# EAGLE design Smart_IOT_v1 (EAGLE 6.6.0)
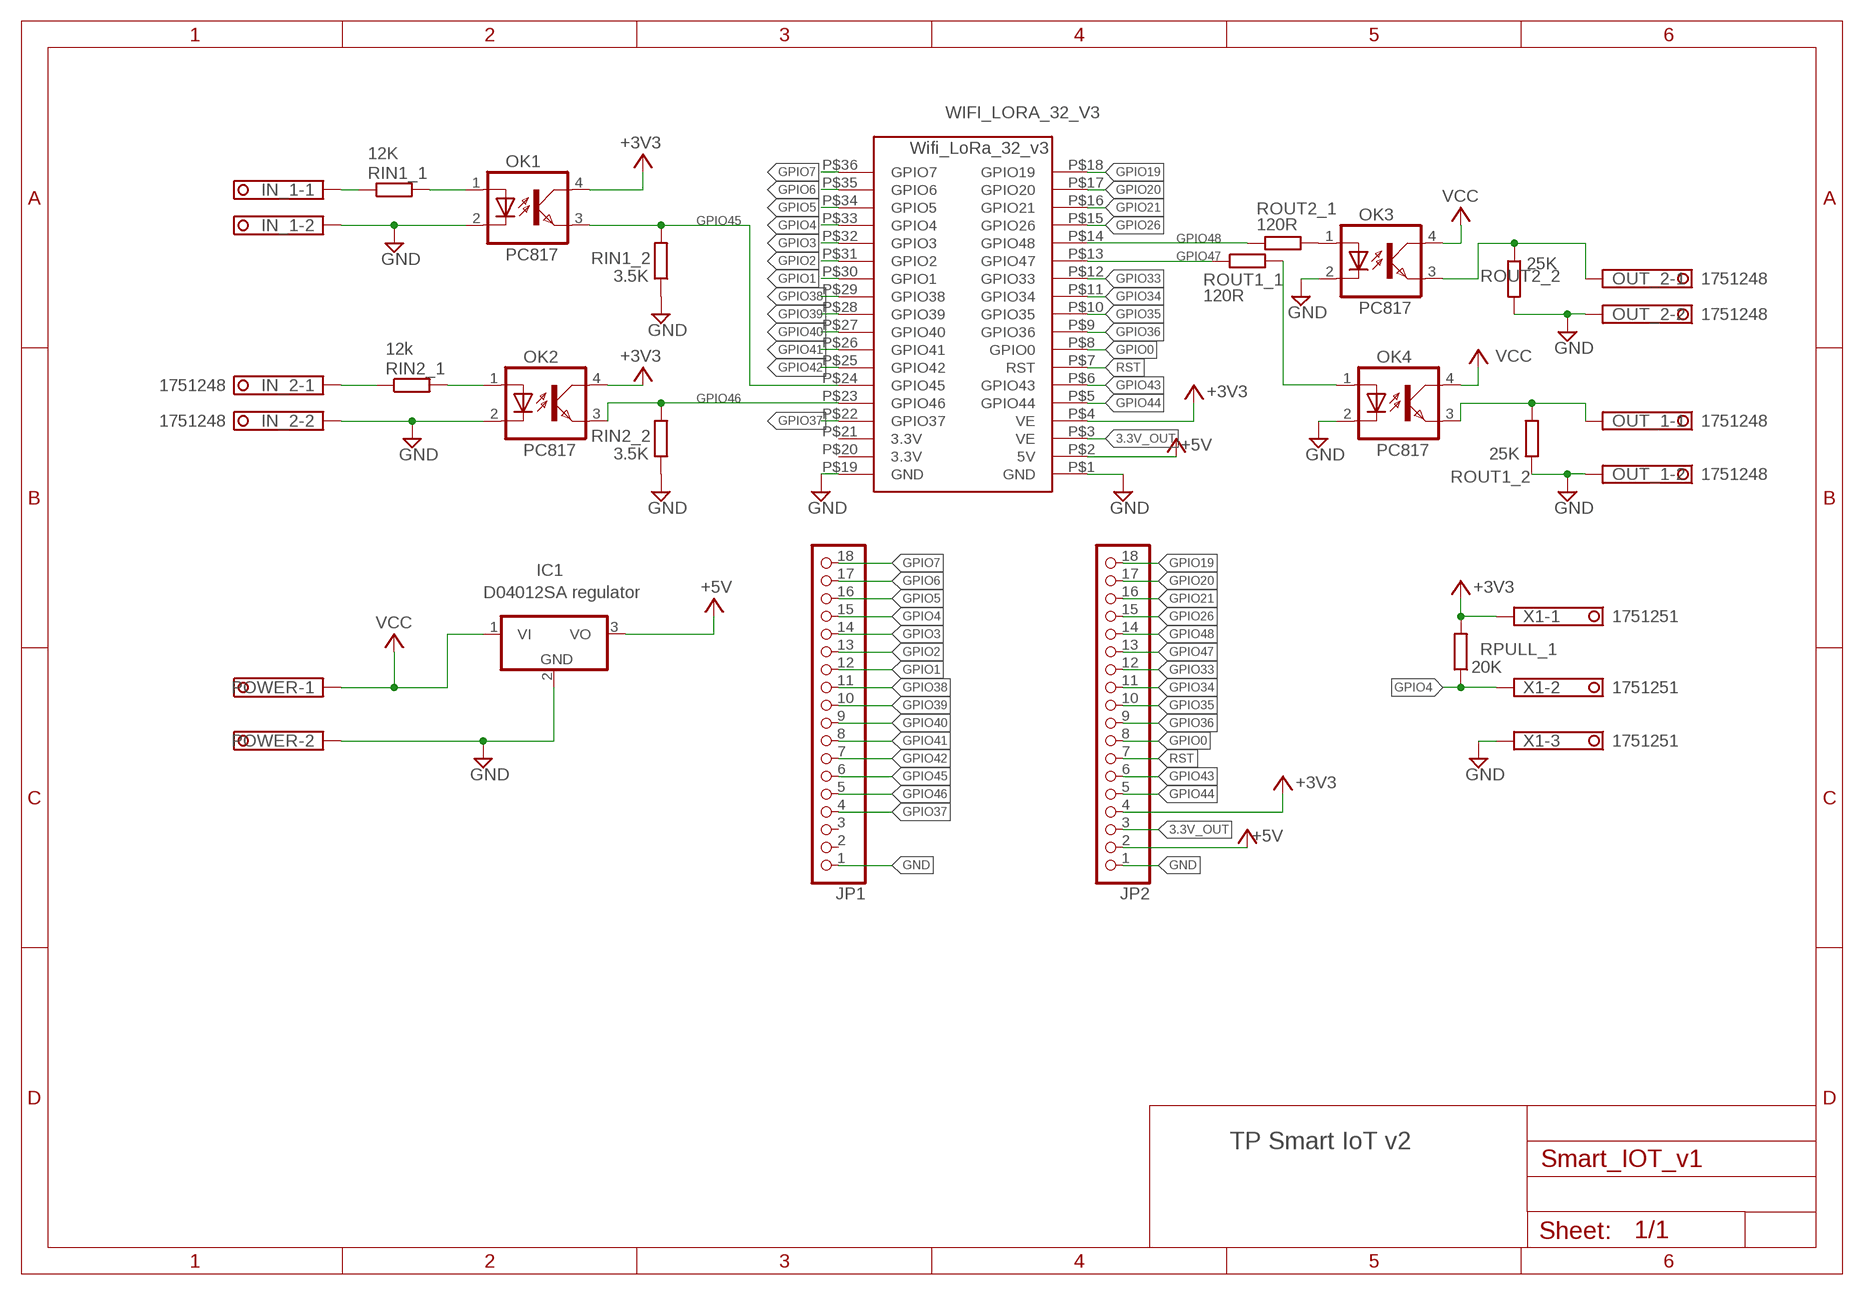
[diagram p0: schematic, sheet 1]

## Parts
IC1  7805TV  [TO220V]
IN_1  1751248  [1751248]
IN_2  1751248  [1751248]
JP1  PINHD-1X18  [1X18]
JP2  PINHD-1X18  [1X18]
OK1  PC817  [DIL04]
OK2  PC817  [DIL04]
OK3  PC817  [DIL04]
OK4  PC817  [DIL04]
OUT_1  1751248  [1751248]
OUT_2  1751248  [1751248]
POWER  1751248  [1751248]
RIN1_1  12K  R-EU_M1206  [M1206]
RIN1_2  3.5K  R-EU_M1206  [M1206]
RIN2_1  12k  R-EU_M1206  [M1206]
RIN2_2  3.5K  R-EU_M1206  [M1206]
ROUT1_1  120R  R-EU_M1206  [M1206]
ROUT1_2  25K  R-EU_M1206  [M1206]
ROUT2_1  120R  R-EU_M1206  [M1206]
ROUT2_2  25K  R-EU_M1206  [M1206]
RPULL_1  20K  R-EU_M1206  [M1206]
WIFI_LORA_32_V3  WIFI_LORA_32_V3  [WIFI_LORA_32_V3]
X1  1751251  [1751251]

## Nets
3.3V_OUT: JP2.3 WIFI_LORA_32_V3.P$3(VE)
+3V3: JP2.4 OK1.4(COL) OK2.4(COL) RPULL_1.2 WIFI_LORA_32_V3.P$4(VE) X1.1
+5V: IC1.3(VO) JP2.2 WIFI_LORA_32_V3.P$2(5V)
GND: IC1.2(GND) IN_1.2 IN_2.2 JP1.1 JP2.1 OK1.2(C) OK2.2(C) OK3.2(C) OK4.2(C) OUT_1.2 OUT_2.2 POWER.2 RIN1_2.1 RIN2_2.1 ROUT1_2.1 ROUT2_2.2 WIFI_LORA_32_V3.P$1(GND) WIFI_LORA_32_V3.P$19(GND) X1.3
GPIO0: JP2.8 WIFI_LORA_32_V3.P$8(GPIO0)
GPIO1: JP1.12 WIFI_LORA_32_V3.P$30(GPIO1)
GPIO2: JP1.13 WIFI_LORA_32_V3.P$31(GPIO2)
GPIO3: JP1.14 WIFI_LORA_32_V3.P$32(GPIO3)
GPIO4: JP1.15 RPULL_1.1 WIFI_LORA_32_V3.P$33(GPIO4) X1.2
GPIO5: JP1.16 WIFI_LORA_32_V3.P$34(GPIO5)
GPIO6: JP1.17 WIFI_LORA_32_V3.P$35(GPIO6)
GPIO7: JP1.18 WIFI_LORA_32_V3.P$36(GPIO7)
GPIO19: JP2.18 WIFI_LORA_32_V3.P$18(GPIO19)
GPIO20: JP2.17 WIFI_LORA_32_V3.P$17(GPIO20)
GPIO21: JP2.16 WIFI_LORA_32_V3.P$16(GPIO21)
GPIO26: JP2.15 WIFI_LORA_32_V3.P$15(GPIO26)
GPIO33: JP2.12 WIFI_LORA_32_V3.P$12(GPIO33)
GPIO34: JP2.11 WIFI_LORA_32_V3.P$11(GPIO34)
GPIO35: JP2.10 WIFI_LORA_32_V3.P$10(GPIO35)
GPIO36: JP2.9 WIFI_LORA_32_V3.P$9(GPIO36)
GPIO37: JP1.4 WIFI_LORA_32_V3.P$22(GPIO37)
GPIO38: JP1.11 WIFI_LORA_32_V3.P$29(GPIO38)
GPIO39: JP1.10 WIFI_LORA_32_V3.P$28(GPIO39)
GPIO40: JP1.9 WIFI_LORA_32_V3.P$27(GPIO40)
GPIO41: JP1.8 WIFI_LORA_32_V3.P$26(GPIO41)
GPIO42: JP1.7 WIFI_LORA_32_V3.P$25(GPIO42)
GPIO43: JP2.6 WIFI_LORA_32_V3.P$6(GPIO43)
GPIO44: JP2.5 WIFI_LORA_32_V3.P$5(GPIO44)
GPIO45: JP1.6 OK1.3(EMIT) RIN1_2.2 WIFI_LORA_32_V3.P$24(GPIO45)
GPIO46: JP1.5 OK2.3(EMIT) RIN2_2.2 WIFI_LORA_32_V3.P$23(GPIO46)
GPIO47: JP2.13 ROUT1_1.1 WIFI_LORA_32_V3.P$13(GPIO47)
GPIO48: JP2.14 ROUT2_1.1 WIFI_LORA_32_V3.P$14(GPIO48)
N$1: OK3.3(EMIT) OUT_2.1 ROUT2_2.1
N$2: IN_1.1 RIN1_1.1
N$3: OK1.1(A) RIN1_1.2
N$5: IN_2.1 RIN2_1.1
N$6: OK2.1(A) RIN2_1.2
N$7: OK3.1(A) ROUT2_1.2
N$10: OK4.1(A) ROUT1_1.2
N$15: OK4.3(EMIT) OUT_1.1 ROUT1_2.2
RST: JP2.7 WIFI_LORA_32_V3.P$7(RST)
VCC: IC1.1(VI) OK3.4(COL) OK4.4(COL) POWER.1
Unconnected: JP1.2 JP1.3 WIFI_LORA_32_V3.P$20(3.3V) WIFI_LORA_32_V3.P$21(3.3V)

## Notes on the sheet
- D04012SA regulator
- TP Smart IoT v2

## Library data of the parts
IC1 = linear:78*: Positive VOLTAGE REGULATOR Source: http://cache.national.com/ds/LM/LM78L05.pdf http://www.fairchildsemi.com/ds/LM/LM7805.pdf
IN_1 IN_2 OUT_1 OUT_2 POWER = con-phoenix-350:1751248: MKDS 1/ 2-3,5 Printklemme Nennstrom: 10 A Bemessungsspannung: 160 V Raster: 3,5 mm Polzahl: 2 Montageart: Löten Anschlussart: Schraubanschluss Anschlussrichtung vom Leiter zur Platine: 0° Source: http://eshop.phoenixcontact.com .. 1751248.pdf; OC_FARNELL: unknown; OC_NEWARK: unknown
JP1 JP2 = pinhead:PINHD-1X18: PIN HEADER
OK1-OK4 = optocoupler:PC817: SHARP OPTO COUPLER; MPN: PC817X4J000F; OC_FARNELL: 9707727; OC_NEWARK: 97K7059
RIN1_1 RIN1_2 RIN2_1 RIN2_2 ROUT1_1 ROUT1_2 ROUT2_1 ROUT2_2 RPULL_1 = rcl:R-EU_: RESISTOR, European symbol
WIFI_LORA_32_V3 = simon:WIFI_LORA_32_V3: Wifi LoRA ESP32 version 3 by HELTEC
X1 = con-phoenix-350:1751251: MKDS 1/ 3-3,5 Printklemme Nennstrom: 10 A Bemessungsspannung: 160 V Raster: 3,5 mm Polzahl: 3 Montageart: Löten Anschlussart: Schraubanschluss Anschlussrichtung vom Leiter zur Platine: 0° Source: http://eshop.phoenixcontact.com .. 1751251.pdf; OC_FARNELL: unknown; OC_NEWARK: unknown

## Board
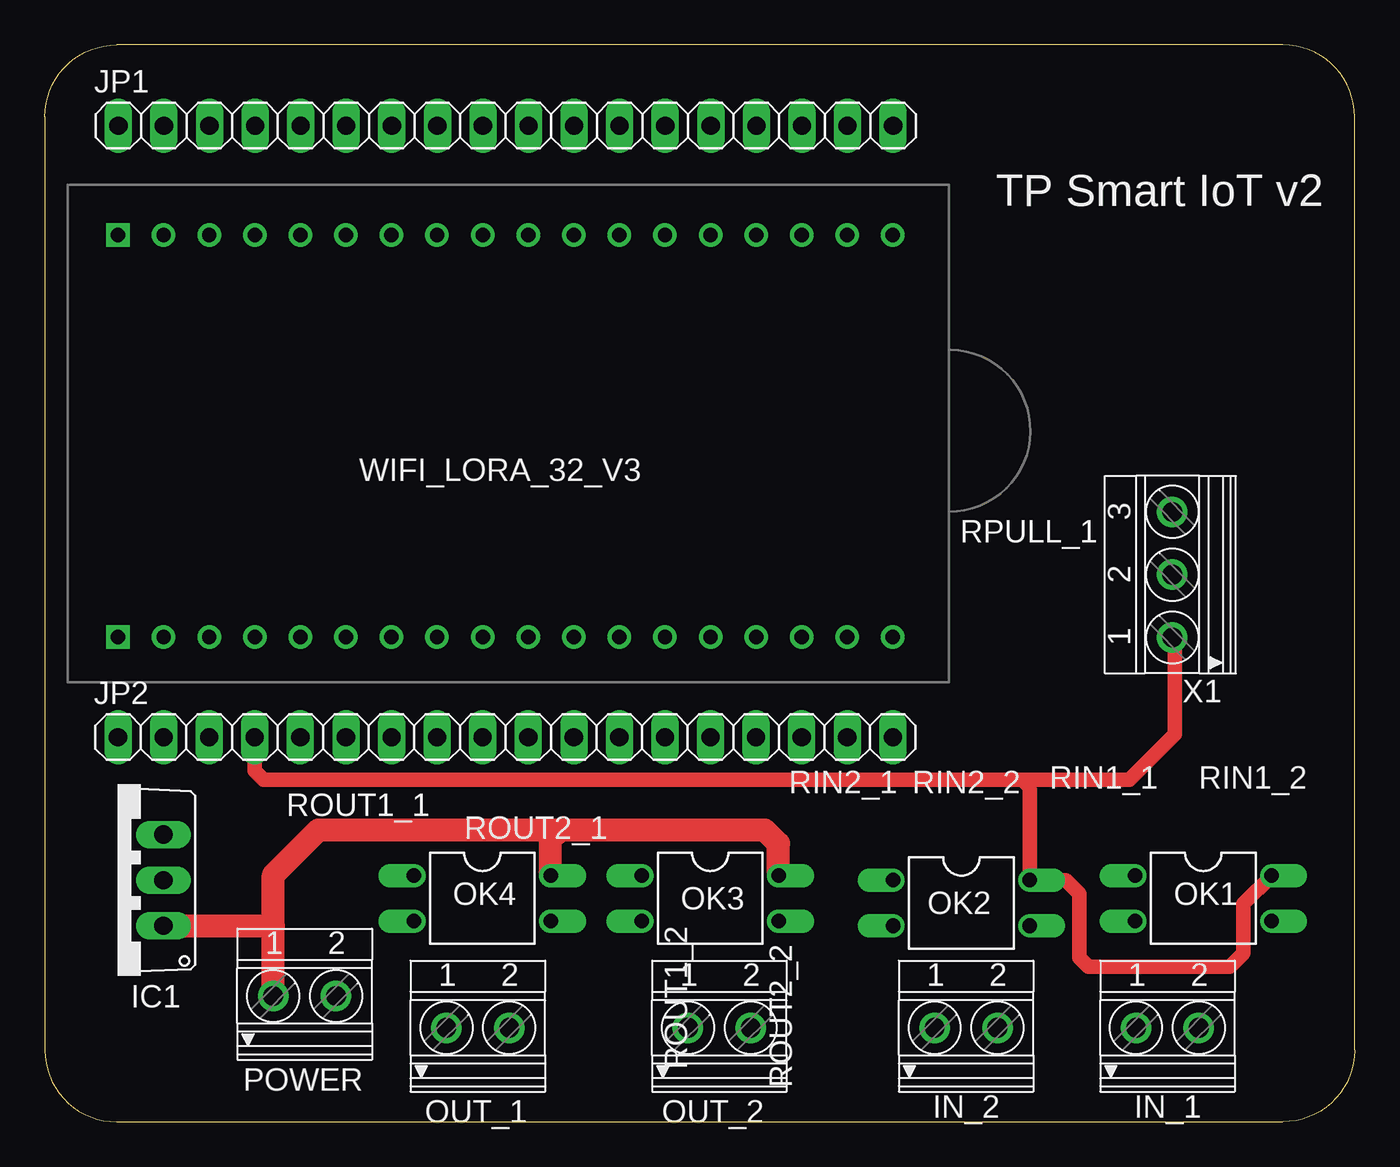
[diagram p1: board, top side]
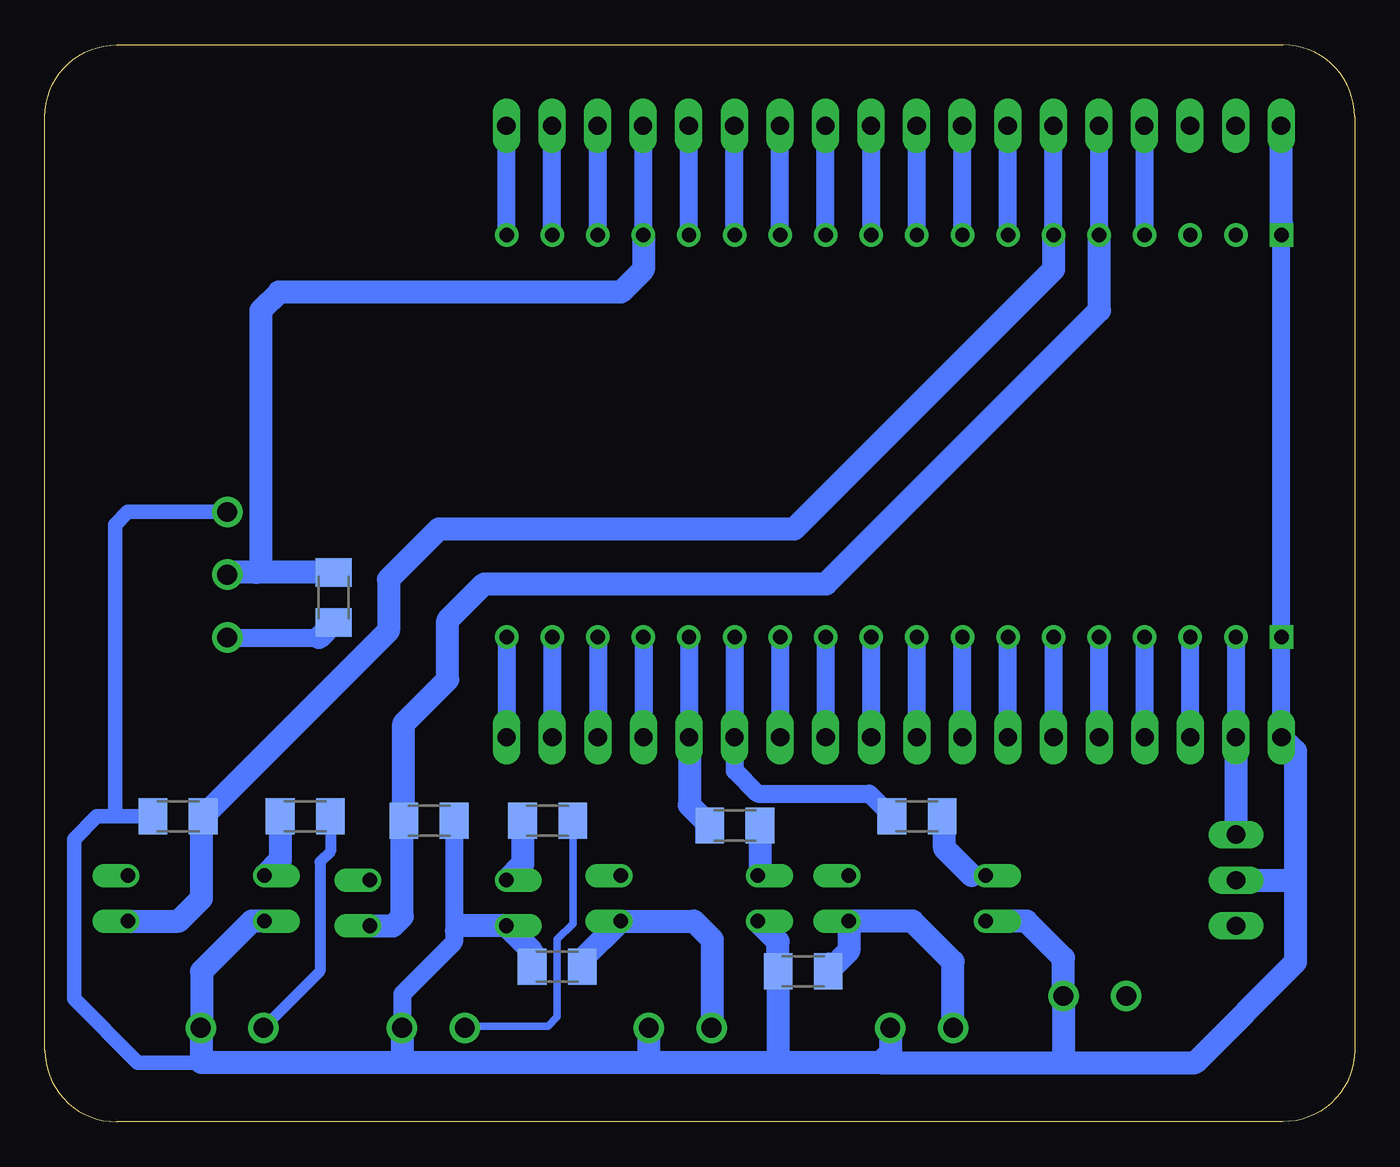
[diagram p2: board, bottom side, seen from below]

Size 73 x 60 mm. Coordinates in mm from the lower left corner, seen from the top.
Outline: 4,0 69,0 arc90 73,4 73,56 arc90 69,60 4,60 arc90 0,56 0,4 arc90 4,0
Copper layers (1*16): Top 0.035mm / dielectric 1.5mm / Bottom 0.035mm
Design rules "default *": minimum track width 10mil, minimum drill 24mil, track to track 8mil, track to pad 8mil, pad to pad 8mil, via to via 8mil, smd to smd 8mil, copper to edge 40mil, drill to drill 8mil, minimum pad ring 10mil, minimum via ring 8mil, stop-mask expansion 4mil, vias tented up to drill 0mil, thermal gap 10mil

### Footprints (pad centres in the part's own frame; a part is rotated, then mirrored left to right if it is on the bottom)
TO220V = drill 1.016 long: 1 -2.54,-2.54; 2 0,-2.54; 3 2.54,-2.54
1751248 = drill 1.1 pad 1.7: 1 -1.75,-0.1; 2 1.75,-0.1
1X18 = drill 1.016 long: 1 -21.59,0; 2 -19.05,0; 3 -16.51,0; 4 -13.97,0; 5 -11.43,0; 6 -8.89,0; 7 -6.35,0; 8 -3.81,0; 9 -1.27,0; 10 1.27,0; 11 3.81,0; 12 6.35,0; 13 8.89,0; 14 11.43,0; 15 13.97,0; 16 16.51,0; 17 19.05,0; 18 21.59,0
DIL04 = drill 0.813 offset: 1 -1.27,-3.81; 2 1.27,-3.81; 3 1.27,3.81; 4 -1.27,3.81
M1206 = smd 1.6 x 2: 1 -1.4,0; 2 1.4,0
WIFI_LORA_32_V3 = drill 0.8 square: P$1 0,0; P$19 0,22.4 | drill 0.8: P$2 2.54,0; P$3 5.08,0; P$4 7.62,0; P$5 10.16,0; P$6 12.7,0; P$7 15.24,0; P$8 17.78,0; P$9 20.32,0; P$10 22.86,0; P$11 25.4,0; P$12 27.94,0; P$13 30.48,0; P$14 33.02,0; P$15 35.56,0; P$16 38.1,0; P$17 40.64,0; P$18 43.18,0; P$20 2.54,22.4; P$21 5.08,22.4; P$22 7.62,22.4; P$23 10.16,22.4; P$24 12.7,22.4; P$25 15.24,22.4; P$26 17.78,22.4; P$27 20.32,22.4; P$28 22.86,22.4; P$29 25.4,22.4; P$30 27.94,22.4; P$31 30.48,22.4; P$32 33.02,22.4; P$33 35.56,22.4; P$34 38.1,22.4; P$35 40.64,22.4; P$36 43.18,22.4
1751251 = drill 1.1 pad 1.7: 1 -3.5,-0.1; 2 0,-0.1; 3 3.5,-0.1

### Placement (x,y rotation side)
IC1  4.06,13.46 90 top
IN_1  62.56,5.33 0 top
IN_2  51.34,5.33 0 top
JP1  25.69,55.5 0 top
JP2  25.67,21.43 0 top
OK1  64.56,12.45 270 top
OK2  51.09,12.19 270 top
OK3  37.08,12.45 270 top
OK4  24.38,12.45 270 top
OUT_1  24.13,5.33 0 top
OUT_2  37.59,5.33 0 top
POWER  14.48,7.11 0 top
RIN1_1  58.48,17.02 180 bottom
RIN1_2  65.58,17.02 0 bottom
RIN2_1  44.97,16.76 180 bottom
RIN2_2  51.59,16.76 180 bottom
ROUT1_1  24.38,17.02 0 bottom
ROUT1_2  30.73,8.38 0 bottom
ROUT2_1  34.54,16.51 0 bottom
ROUT2_2  44.45,8.64 180 bottom
RPULL_1  56.9,29.21 270 bottom
WIFI_LORA_32_V3  4.08,27 0 top
X1  62.74,30.48 90 top

### Tracks (layer width: path | path; a pad name or v marks a point on that pad's centre or on a via)
3.3V_OUT
  Bottom 1.016: JP2.3 WIFI_LORA_32_V3.P$3
+3V3
  Top 0.61: 54.9,18.51 54.36,19.05 | 11.68,21.41 JP2.4 | 62.99,26.83 X1.1
  Top 0.813: 54.9,18.51 OK2.4 56.9,13.46 57.66,12.7 57.66,9.14 58.17,8.64 66.04,8.64 66.8,9.4 66.8,12.14 OK1.4 | 11.68,21.41 11.68,19.56 12.19,19.05 54.36,19.05 60.45,19.05 62.99,21.59 62.99,26.83
  Bottom 1.016: JP2.4 WIFI_LORA_32_V3.P$4 | 57.73,26.98 X1.1 62.89,26.92
  Bottom 1.27: 57.73,26.98 RPULL_1.2
+5V
  Bottom 0.61: 6.6,21.41 JP2.2
  Bottom 1.016: WIFI_LORA_32_V3.P$2 JP2.2
  Bottom 1.27: IC1.3 6.6,21.41
GND
  Bottom 0.61: WIFI_LORA_32_V3.P$19 4.08,50.04 | 4.08,55.48 JP1.1 | 4.06,21.41 JP2.1 | 50.16,10.89 50.19,10.92
  Bottom 0.813: OK2.2 47.28,10.89 | 64.26,5.29 IN_1.2 | RIN1_2.1 69.09,17.02 | 69.09,17.02 70.1,17.02 71.37,15.75 71.37,6.86 67.82,3.3 63.75,3.3 | X1.3 68.38,33.98 69.09,33.27 69.09,17.02
  Bottom 1.016: JP2.1 WIFI_LORA_32_V3.P$1 4.08,50.04 | RIN2_2.1 50.19,10.67 | 50.19,10.67 50.19,10 53.09,7.11 IN_2.2 | 49.94,10.92 50.16,10.7 | 50.16,10.89 50.16,10.7 | 50.16,10.7 50.19,10.67
  Bottom 1.27: 4.08,50.04 4.08,55.48 | JP2.1 3.3,20.65 3.3,13.21 | 3.3,13.21 3.3,8.89 8.89,3.3 16.26,3.3 | IC1.2 3.56,13.46 3.3,13.21 | 25.88,3.84 26.42,3.3 | 16.26,6.98 POWER.2 | OK1.2 61.47,11.18 64.26,8.38 64.26,5.29 | 26.42,3.3 31.75,3.3 | 31.75,3.3 39.37,3.3 | 39.37,3.3 51.82,3.3 | 51.82,3.3 53.09,3.3 | 53.09,3.3 63.75,3.3 64.26,3.3 64.26,5.18 IN_1.2 | 51.82,3.31 51.82,3.3 | OUT_2.2 39.34,3.33 39.37,3.3 | IN_2.2 53.09,3.31 53.09,3.3 | ROUT2_2.2 45.85,9.5 OK2.2 49.94,10.92 | 31.75,3.3 32.13,3.69 ROUT1_2.1 32.13,10.04 OK3.2 | OK4.2 18.29,11.18 16.23,9.12 POWER.2 | 26.42,3.3 26.16,3.3 | 26.16,3.3 16.26,3.3 | POWER.2 16.23,3.33 16.26,3.3 | OUT_1.2 25.88,3.58 26.16,3.3
GPIO0
  Bottom 1.016: JP2.8 WIFI_LORA_32_V3.P$8
GPIO1
  Bottom 0.61: 32.02,55.48 JP1.12
  Bottom 1.016: WIFI_LORA_32_V3.P$30 32.02,55.48
GPIO2
  Bottom 0.61: 34.56,55.48 JP1.13
  Bottom 1.016: WIFI_LORA_32_V3.P$31 34.56,55.48
GPIO3
  Bottom 0.61: 37.1,55.48 JP1.14
  Bottom 1.016: WIFI_LORA_32_V3.P$32 37.1,55.48
GPIO4
  Bottom 0.61: 39.64,55.48 JP1.15 | 60.96,30.86 61.21,30.61
  Bottom 1.016: WIFI_LORA_32_V3.P$33 39.64,55.48 | 62.71,30.61 X1.2
  Bottom 1.27: RPULL_1.1 61.21,30.61 62.71,30.61 | WIFI_LORA_32_V3.P$33 39.64,47.48 40.89,46.23 59.94,46.23 60.96,45.21 60.96,30.86
GPIO5
  Bottom 0.61: 42.18,55.48 JP1.16
  Bottom 1.016: WIFI_LORA_32_V3.P$34 42.18,55.48
GPIO6
  Bottom 0.61: 44.72,55.48 JP1.17
  Bottom 1.016: WIFI_LORA_32_V3.P$35 44.72,55.48
GPIO7
  Bottom 0.61: 47.26,55.48 JP1.18
  Bottom 1.016: WIFI_LORA_32_V3.P$36 47.26,55.48
GPIO19
  Bottom 1.016: WIFI_LORA_32_V3.P$18 JP2.18
GPIO20
  Bottom 1.016: WIFI_LORA_32_V3.P$17 JP2.17
GPIO21
  Bottom 1.016: WIFI_LORA_32_V3.P$16 JP2.16
GPIO26
  Bottom 1.016: WIFI_LORA_32_V3.P$15 JP2.15
GPIO33
  Bottom 1.016: WIFI_LORA_32_V3.P$12 JP2.12
GPIO34
  Bottom 1.016: WIFI_LORA_32_V3.P$11 JP2.11
GPIO35
  Bottom 1.016: JP2.10 WIFI_LORA_32_V3.P$10
GPIO36
  Bottom 1.016: JP2.9 WIFI_LORA_32_V3.P$9
GPIO37
  Bottom 0.61: 11.7,55.48 JP1.4
  Bottom 1.016: WIFI_LORA_32_V3.P$22 11.7,55.48
GPIO38
  Bottom 0.61: 29.48,55.48 JP1.11
  Bottom 1.016: WIFI_LORA_32_V3.P$29 29.48,55.48
GPIO39
  Bottom 0.61: 26.94,55.48 JP1.10
  Bottom 1.016: WIFI_LORA_32_V3.P$28 26.94,55.48
GPIO40
  Bottom 0.61: 24.4,55.48 JP1.9
  Bottom 1.016: WIFI_LORA_32_V3.P$27 24.4,55.48
GPIO41
  Bottom 0.61: 21.86,55.48 JP1.8
  Bottom 1.016: WIFI_LORA_32_V3.P$26 21.86,55.48
GPIO42
  Bottom 0.61: 19.32,55.48 JP1.7
  Bottom 1.016: WIFI_LORA_32_V3.P$25 19.32,55.48
GPIO43
  Bottom 1.016: WIFI_LORA_32_V3.P$6 JP2.6
GPIO44
  Bottom 1.016: JP2.5 WIFI_LORA_32_V3.P$5
GPIO45
  Bottom 0.61: 16.78,55.48 JP1.6 | 64.26,16.94 RIN1_2.2 | 16.76,49.39 WIFI_LORA_32_V3.P$24
  Bottom 1.016: WIFI_LORA_32_V3.P$24 16.78,55.48
  Bottom 1.27: OK1.3 65.53,11.18 64.26,12.45 64.26,16.94 | WIFI_LORA_32_V3.P$24 16.78,47.48 31.24,33.02 51.05,33.02 53.85,30.23 53.85,27.35 RIN1_2.2
GPIO46
  Bottom 0.61: 14.24,55.48 JP1.5 | 53.09,16.67 RIN2_2.2 | 29.72,29.72 29.46,29.97 | 14.22,49.39 WIFI_LORA_32_V3.P$23
  Bottom 1.016: WIFI_LORA_32_V3.P$23 14.24,55.48
  Bottom 1.27: OK2.3 53.59,10.92 53.09,11.43 53.09,16.67 | 14.22,49.39 14.22,45.21 29.46,29.97 48.51,29.97 50.55,27.94 50.55,24.64 52.99,22.19 RIN2_2.2
GPIO47
  Bottom 1.016: WIFI_LORA_32_V3.P$13 JP2.13 34.54,21.41 34.54,19.56 33.27,18.29 27.05,18.29 ROUT1_1.1
GPIO48
  Bottom 0.406: 37.08,21.41 JP2.14
  Bottom 1.016: WIFI_LORA_32_V3.P$14 JP2.14
  Bottom 1.27: 37.08,21.41 37.08,17.65 ROUT2_1.1
N$1
  Bottom 0.61: 35.81,5.26 OUT_2.1
  Bottom 1.27: 35.81,5.26 35.81,10.16 36.83,11.18 OK3.3 43.05,9.02 ROUT2_2.1
N$2
  Bottom 0.61: RIN1_1.1 57.08,15.05 57.66,14.48 57.66,8.39 IN_1.1
N$3
  Bottom 1.27: RIN1_1.2 59.88,14.59 OK1.1
N$5
  Bottom 0.406: RIN2_1.1 43.57,11.04 44.45,10.16 44.45,5.84 44.96,5.33 49.49,5.33 IN_2.1
N$6
  Bottom 1.27: RIN2_1.2 46.37,14.36 OK2.1
N$7
  Bottom 1.016: 33.14,13.85 OK3.1
  Bottom 1.27: ROUT2_1.2 33.14,13.85
N$10
  Bottom 1.016: OK4.1 21.34,13.72
  Bottom 1.27: 21.34,13.72 22.86,15.24 22.86,16.89 ROUT1_1.2
N$15
  Bottom 0.813: ROUT1_2.2 29.33,9.02
  Bottom 1.27: OUT_1.1 22.38,8.92 24.64,11.18 OK4.3 28.19,9.52 ROUT1_2.2
RST
  Bottom 1.016: JP2.7 WIFI_LORA_32_V3.P$7
VCC
  Top 1.27: OK3.4 40.89,15.49 40.13,16.26 28.7,16.26 | 28.7,16.26 15.24,16.26 12.73,13.74 12.73,10.92 | OK4.4 28.19,15.75 28.7,16.26 | POWER.1 12.73,10.92 | IC1.1 12.73,10.92

### Text on the board
tNames: TP Smart IoT v2